# Altium project PCB_Project2.PrjPCB
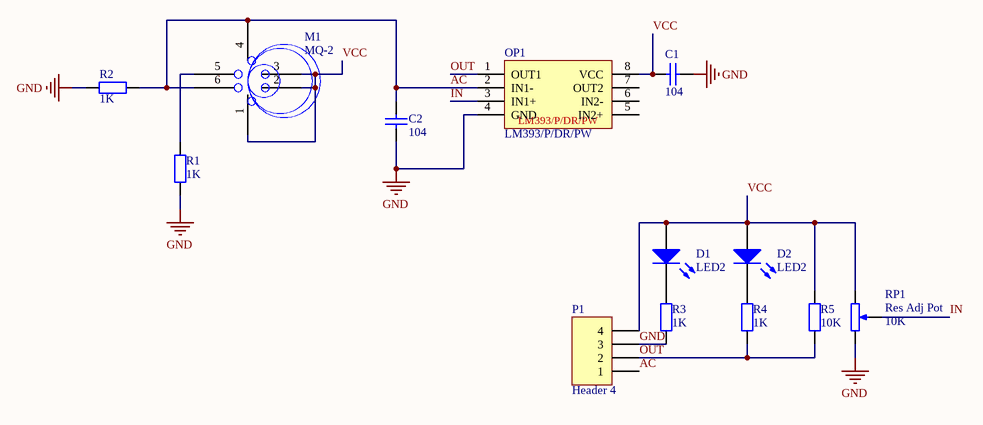
[diagram p0: Sheet1.SchDoc]
1 sheet, 13 parts. Net scope: global (net labels, ports and power ports of the same name join across sheets).
Board file: PCB1.PcbDoc

## Sheet Sheet1.SchDoc
size A4

### Parts
C1  value 104  [CC2012-0805]  (hidden comment: Cap Chip 0805)
C2  value 104  [CC2012-0805]  (hidden comment: Cap Chip 0805)
D1  LED2  [3.2X1.6X1.1]
D2  LED2  [3.2X1.6X1.1]
M1  MQ-2  [PCBComponent_1]
OP1  LM393/P/DR/PW  [DIP-8]
P1  Header 4  [HDR1X4]
R1  value 1K  [CR2012-0805]  (hidden comment: Resistor Chip 0805)
R2  value 1K  [CR2012-0805]  (hidden comment: Resistor Chip 0805)
R3  value 1K  [CR2012-0805]  (hidden comment: Resistor Chip 0805)
R4  value 1K  [CR2012-0805]  (hidden comment: Resistor Chip 0805)
R5  value 10K  [CR2012-0805]  (hidden comment: Resistor Chip 0805)
RP1  Res Adj Pot  value 10K  [POT BIG]

### Nets
GND: C1.2 C2.1 OP1.4(GND) P1.3 R1.1 R2.1 R3.1 RP1.1(TOP)
AC: C2.2 M1.4(H2) M1.6(B2) OP1.2(IN1-) P1.1 R2.2
IN: OP1.3(IN1+) RP1.3(TAP)
OUT: OP1.1(OUT1) P1.2 R4.1 R5.1
VCC: C1.1 D1.1(A) D2.1(A) M1.1(H1) M1.2 M1.3(A1) OP1.8(VCC) P1.4 R5.2 RP1.2(BOT)
NetD1_2: D1.2(K) R3.2
NetD2_2: D2.2(K) R4.2
NetM1_5: M1.5(A2) R1.2

Not connected (* = marked no-connect by the designer): OP1 5(IN2+) 6(IN2-) 7(OUT2)

### Library data of the parts
C1 C2 = Cap Chip 0805: Polarized Capacitor (Radial); Published: 8-Jun-2000; Revision: July-2002: Re-released for DXP Platform.; Publisher: Altium Limited
D1 D2 = LED2: Typical RED, GREEN, YELLOW, AMBER GaAs LED; Published: 8-Jun-2000; LatestRevisionDate: 17-Jul-2002; LatestRevisionNote: Re-released for DXP Platform.; PackageVersion: Feb-2002; PackageReference: 3.2X1.6X1.1; Publisher: Altium Limited; PackageDescription: SM LED; 2 Flat Leads
P1 = Header 4: Header, 4-Pin; LatestRevisionDate: 17-Jul-2002; LatestRevisionNote: Re-released for DXP Platform.; Publisher: Altium Limited
R1-R5 = Resistor Chip 0805: Resistor; Published: 8-Jun-2000; Revision: July-2002: Re-released for DXP Platform.; Publisher: Altium Limited
RP1 = Res Adj Pot: Potentiometer; Set Position: 0.5; Published: 8-Jun-2000; Revision: July-2002: Re-released for DXP Platform.; Publisher: Altium Limited